# Altium schematic sheet Schematic.SchDoc
size A4
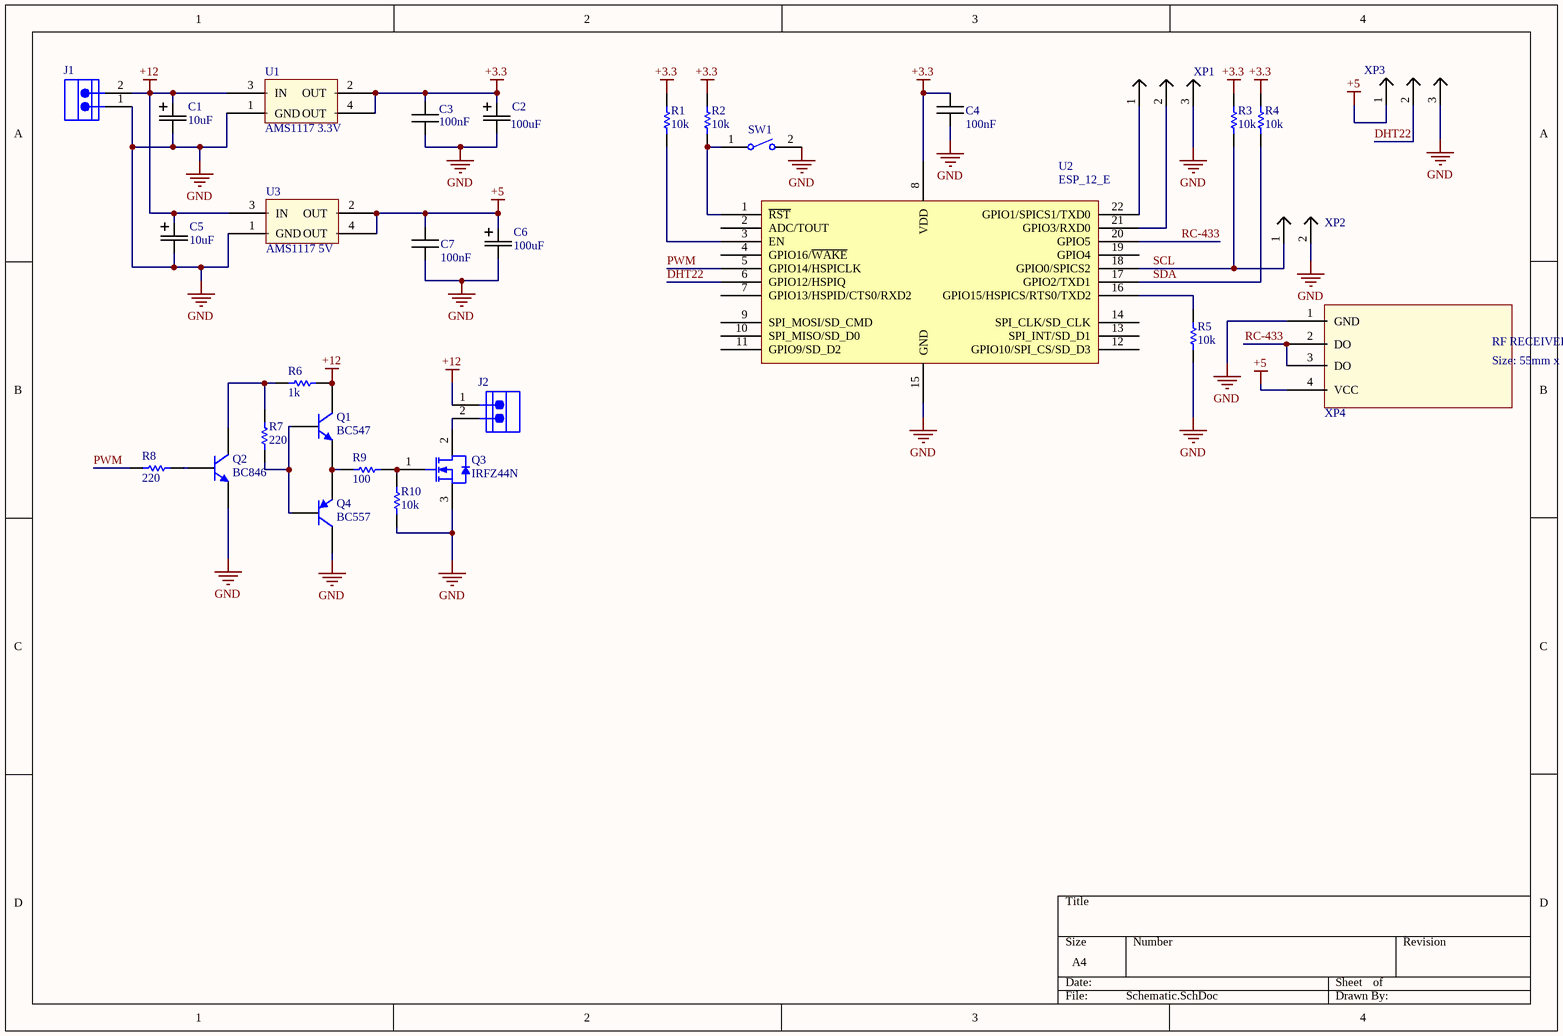
[diagram p0: Schematic.SchDoc]

## Parts
C1  Val: 10uF  [CAP_ELEC_5*11]  (hidden comment: CAP_ELEC_5*11)
C2  Val: 100uF  [CAP_ELEC_8*11]  (hidden comment: CAP_ELEC_8*11)
C3  Val: 100nF  [CAP0805]  (hidden comment: CAP_SMD)
C4  Val: 100nF  [CAP0805]  (hidden comment: CAP_SMD)
C5  Val: 10uF  [CAP_ELEC_5*11]  (hidden comment: CAP_ELEC_5*11)
C6  Val: 100uF  [CAP_ELEC_8*11]  (hidden comment: CAP_ELEC_8*11)
C7  Val: 100nF  [CAP0805]  (hidden comment: CAP_SMD)
J1  (no value)  [KF350-3.5-02P]
J2  (no value)  [KF350-3.5-02P]
Q1  BC547  [TO-92A]
Q2  BC846  [SOT23 - 123]
Q3  IRFZ44N  [TO-220]
Q4  BC557  [TO-92A]
R1  Val: 10k  [RES0805]  (hidden comment: RES_SMD)
R2  Val: 10k  [RES0805]  (hidden comment: RES_SMD)
R3  Val: 10k  [RES0805]  (hidden comment: RES_SMD)
R4  Val: 10k  [RES0805]  (hidden comment: RES_SMD)
R5  Val: 10k  [RES0805]  (hidden comment: RES_SMD)
R6  Val: 1k  [RES0805]  (hidden comment: RES_SMD)
R7  Val: 220  [RES0805]  (hidden comment: RES_SMD)
R8  Val: 220  [RES0805]  (hidden comment: RES_SMD)
R9  Val: 100  [RES0805]  (hidden comment: RES_SMD)
R10  Val: 10k  [RES0805]  (hidden comment: RES_SMD)
SW1  (no value)  [SMD_BUT_6.3mm]
U1  AMS1117 3.3V  [SOT223-4]
U2  ESP_12_E  [ESP_12_E]
U3  AMS1117 5V  [SOT223-4]
XP1  PLS-03  [PLS-03]  (value not drawn)
XP2  PLS-02  [PLS-02]  (value not drawn)
XP3  PBS-03  [PBS-03]  (value not drawn)
XP4  RF_RECEIVER  [RF RECEIVER]  (value not drawn)

## Nets
+3.3: C2.2 C3.2 C4.2 R1.2 R2.2 R3.2 R4.2 U1.2(OUT) U1.4(OUT) U2.8(VDD)
+5: C6.2 C7.2 U3.2(OUT) U3.4(OUT) XP3.1 XP4.4(VCC)
+12: C1.2 C5.2 J1.2 J2.1 Q1.1(C) R6.1 U1.3(IN) U3.3(IN)
GND: C1.1 C2.1 C3.1 C4.1 C5.1 C6.1 C7.1 J1.1 Q2.3(E) Q3.3(S) Q4.1(C) R5.1 R10.2 SW1.2 U1.1(GND) U2.15(GND) U3.1(GND) XP1.3 XP2.2 XP3.3 XP4.1(GND)
DHT22: U2.6(GPIO12/HSPIQ) XP3.2
PWM: R8.2 U2.5(GPIO14/HSPICLK)
RC-433: U2.20(GPIO5) XP4.2(DO) XP4.3(DO)
SCL: R3.1 U2.18(GPIO0/SPICS2) XP2.1
SDA: R4.1 U2.17(GPIO2/TXD1)
NetJ2_2: J2.2 Q3.2(D)
NetQ1_2: Q1.2(B) Q4.2(B) R7.2
NetQ1_3: Q1.3(E) Q4.3(E) R9.2
NetQ2_1: Q2.1(C) R6.2 R7.1
NetQ2_2: Q2.2(B) R8.1
NetQ3_1: Q3.1(G) R9.1 R10.1
NetR1_1: R1.1 U2.3(EN)
NetR2_1: R2.1 SW1.1 U2.1(~{RST})
NetR5_2: R5.2 U2.16(GPIO15/HSPICS/RTS0/TXD2)
NetU2_21: U2.21(GPIO3/RXD0) XP1.2
NetU2_22: U2.22(GPIO1/SPICS1/TXD0) XP1.1

Not connected (* = marked no-connect by the designer): U2 2(ADC/TOUT) 4(GPIO16/~{WAKE}) 7(GPIO13/HSPID/CTS0/RXD2) 9(SPI_MOSI/SD_CMD) 10(SPI_MISO/SD_D0) 11(GPIO9/SD_D2) 12(GPIO10/SPI_CS/SD_D3) 13(SPI_INT/SD_D1) 14(SPI_CLK/SD_CLK) 19(GPIO4)

## Notes on the sheet
- (in symbol RF_RECEIVER) RF RECEIVER 433MHz; Size: 55mm x 10mm

## Library data of the parts
C1 C5 = CAP_ELEC_5*11: Electrolitic capacitor
C2 C6 = CAP_ELEC_8*11: Electrolitic capacitor
C3 C4 C7 = CAP_SMD: Ceramic capacitor, 0805
J1 J2 = Terminal_2: Euro Terminal Block, 6 A, 150 V, -40 to 105 degC, Pitch 2.54 mm, 1x2 Position, Height 8.6 mm, Tail Length 3.3 mm; Manufacturer: Cixi KaiFeng; PartNumber: KF120-02P-14; Rated Current: 6 A; Contact: Brass; Insulation Resistance: 5000 MOhm / 1000 V; Rated Voltage: 150 V; No. of Pole: 2; Withstanding Voltage: AC 1500 V / 1 Min; Contact Resistance: 20 mOhm; Pitch: Single Pitch; PackageReference: KF120-2; Color: Green; Mounting Technology: Through Hole; PackageDescription: Terminal Block, Pitch 2.54 mm, 1 x 2 Position, Height 8.6 mm, Tail Length 3.3 mm; ComponentLink2Description: Datasheet; ComponentLink1Description: Manufacturer URL; ComponentLink2URL: http://www.nb-kaifeng.com/upload/editor/ext_pdf/201305290533202245.pdf; Temp. Range: -40 to 105 degC; ComponentLink1URL: http://www.nb-kaifeng.com/
Q1 = BC547: NPN Bipolar Transistor; Published: 8-Jun-2000; LatestRevisionDate: 17-Jul-2002; LatestRevisionNote: Re-released for DXP Platform.; PackageReference: TO-226-AA; Publisher: Altium Limited; PackageDescription: TO, Flat Index; 3 In-Line, Axial Leads; Body Dia. 4.8mm; Leads 0.55 x 0.51 mm (max); Code_JEDEC: TO-226-AA
Q2 = BC846: NPN Bipolar Transistor; pin to pad: 1>3 2>1 3>2; Published: 8-Jun-2000; LatestRevisionDate: 17-Jul-2002; LatestRevisionNote: Re-released for DXP Platform.; PackageReference: TO-226-AA; Publisher: Altium Limited; PackageDescription: TO, Flat Index; 3 In-Line, Axial Leads; Body Dia. 4.8mm; Leads 0.55 x 0.51 mm (max); Code_JEDEC: TO-226-AA
Q3 = IRFZ44N: N-channel Enhancement Mode Power MOSFET 49A/55V
Q4 = BC557: PNP Transistor; Published: 8-Jun-2000; LatestRevisionDate: 17-Jul-2002; LatestRevisionNote: Re-released for DXP Platform.; PackageReference: TO-226-AA; Publisher: Altium Limited; PackageDescription: TO, Flat Index; 3 In-Line, Axial Leads; Body Dia. 4.8mm; Leads 0.55 x 0.51 mm (max); Code_JEDEC: TO-226-AA
SW1 = Button_2_SMD: SMD Switch; Manufacturer: TE Connectivity; Actuator Length: 1.07mm; Electrical Life: 20000Cycles; Actuator Material: Polyamide; Current Rating: 50mA; Illumination Type: Illuminated; Voltage Rating (DC): 24V; Contact Resistance: 100mOhm; Case\/Package: SMD/SMT; Operating Force: 180gf; Switch Travel: 0.25mm; Max Voltage Rating (DC): 12V; Throw Configuration: SPST; Packaging: LoosePiece; Max Operating Temperature: 85degC; ELV: Compliant; Package Description: 2-Pin Surface Mount Device, Body 6 x 3.5 mm, Pitch 9.19 mm; RoHSCompliant: true; Manufacturer URL: http://www.te.com/; Contact Plating: Silver; Contact Material: Brass; Mounting Technology: SurfaceMount; Contact Current Rating: 50mA; Datasheet Version: Rev. C2, 08/2014; Datasheet URL: http://www.te.com/commerce/DocumentDelivery/DDEController?Action=showdoc&DocId=Customer+Drawing%7F1437566-3%7FC2%7Fpdf%7FEnglish%7FENG_CD_1437566-3_C2_1437566_3_1_c.dwg.pdf%7F1437566-3; Mechanical Life: 20000Cycles; Package Reference: FSMSM; REACH SVHC: Unknown; Orientation: Straight; Min Operating Temperature: -35degC; Lead Free: LeadFree; Termination: GullWing; Package Quantity: 1000; Mount: SurfaceMount
U1 U3 = AMS1117: Voltage regulator
U2 = ESP_12_E: ESP-12 Wi-Fi Module by AI-Thinker; IC: ESP8266-EX; Vendor: Ai-thinker